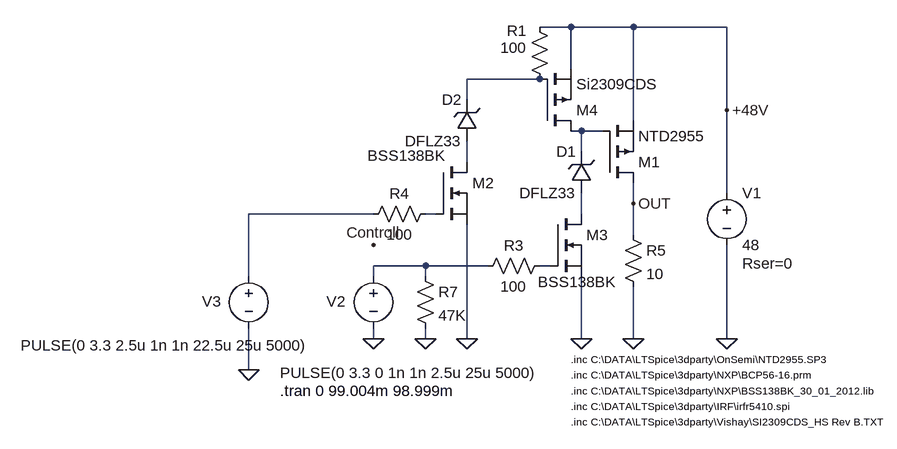
[diagram p0: schematic driver_v5_pfet_off_resistive.asc]
driver_v5_pfet_off_resistive.asc, the LTspice schematic file:
Version 4
SHEET 1 968 680
WIRE 416 -128 368 -128
WIRE 512 -128 416 -128
WIRE 656 -128 512 -128
WIRE 416 -64 416 -128
WIRE 368 -48 256 -48
WIRE 256 -16 256 -48
WIRE 656 0 656 -128
WIRE 512 16 512 -128
WIRE 432 32 416 32
WIRE 464 32 432 32
WIRE 432 64 432 32
WIRE 256 80 256 48
WIRE 656 128 656 0
WIRE 512 144 512 112
WIRE 112 160 -80 160
WIRE 208 160 192 160
WIRE 432 160 432 128
WIRE 512 192 512 144
WIRE 192 240 112 240
WIRE 288 240 192 240
WIRE 384 240 368 240
WIRE -80 256 -80 160
WIRE 112 256 112 240
WIRE 192 256 192 240
WIRE 112 352 112 336
WIRE 192 352 192 336
WIRE 256 352 256 176
WIRE 432 352 432 256
WIRE 512 352 512 272
WIRE 656 352 656 208
WIRE -80 400 -80 336
FLAG 512 352 0
FLAG 656 352 0
FLAG 112 352 0
FLAG 656 0 +48V
FLAG 112 208 Controll
FLAG 512 144 OUT
FLAG 432 352 0
FLAG 192 352 0
FLAG 256 352 0
FLAG -80 400 0
SYMBOL pmos 464 112 M180
SYMATTR InstName M1
SYMATTR Value NTD2955
SYMATTR Prefix X
SYMBOL res 352 -144 R0
WINDOW 0 -35 22 Left 2
WINDOW 3 -45 48 Left 2
SYMATTR InstName R1
SYMATTR Value 100
SYMBOL res 208 144 R90
WINDOW 0 0 56 VBottom 2
WINDOW 3 32 56 VTop 2
SYMATTR InstName R4
SYMATTR Value 100
SYMBOL res 496 176 R0
SYMATTR InstName R5
SYMATTR Value 10
SYMBOL voltage 656 112 R0
WINDOW 123 0 0 Left 2
WINDOW 39 24 124 Left 2
SYMATTR SpiceLine Rser=0
SYMATTR InstName V1
SYMATTR Value 48
SYMBOL voltage 112 240 R0
WINDOW 0 -72 55 Left 2
WINDOW 3 -144 165 Left 2
WINDOW 123 0 0 Left 2
WINDOW 39 0 0 Left 2
SYMATTR InstName V2
SYMATTR Value PULSE(0 3.3 0 1n 1n 2.5u 25u 5000)
SYMBOL zener 448 128 R180
WINDOW 0 24 64 Left 2
WINDOW 3 24 0 Left 2
SYMATTR InstName D1
SYMATTR Value DFLZ33
SYMATTR Description Diode
SYMATTR Type diode
SYMBOL nmos 208 80 R0
WINDOW 3 -105 -10 Left 2
SYMATTR Value BSS138BK
SYMATTR InstName M2
SYMATTR Prefix X
SYMBOL nmos 384 160 R0
WINDOW 3 -19 105 Left 2
SYMATTR Value BSS138BK
SYMATTR InstName M3
SYMATTR Prefix X
SYMBOL res 384 224 R90
WINDOW 0 0 56 VBottom 2
WINDOW 3 32 56 VTop 2
SYMATTR InstName R3
SYMATTR Value 100
SYMBOL res 176 240 R0
SYMATTR InstName R7
SYMATTR Value 47K
SYMBOL pmos 368 32 M180
SYMATTR InstName M4
SYMATTR Value Si2309CDS
SYMATTR Prefix X
SYMBOL zener 272 48 R180
WINDOW 0 24 64 Left 2
WINDOW 3 24 0 Left 2
SYMATTR InstName D2
SYMATTR Value DFLZ33
SYMATTR Description Diode
SYMATTR Type diode
SYMBOL voltage -80 240 R0
WINDOW 0 -72 55 Left 2
WINDOW 3 -351 122 Left 2
WINDOW 123 0 0 Left 2
WINDOW 39 0 0 Left 2
SYMATTR InstName V3
SYMATTR Value PULSE(0 3.3 2.5u 1n 1n 22.5u 25u 5000)
TEXT -32 432 Left 2 !.tran 0 99.004m 98.999m
TEXT 416 408 Left 1 !.inc C:\\DATA\\LTSpice\\3dparty\\NXP\\BCP56-16.prm
TEXT 416 432 Left 1 !.inc C:\\DATA\\LTSpice\\3dparty\\NXP\\BSS138BK_30_01_2012.lib
TEXT 416 384 Left 1 !.inc C:\\DATA\\LTSpice\\3dparty\\OnSemi\\NTD2955.SP3
TEXT 416 456 Left 1 !.inc C:\\DATA\\LTSpice\\3dparty\\IRF\\irfr5410.spi
TEXT 416 480 Left 1 !.inc C:\\DATA\\LTSpice\\3dparty\\Vishay\\SI2309CDS_HS Rev B.TXT

The netlist it stands for:
* driver_v5_pfet_off_resistive.asc
XM1 OUT N002 +48V NTD2955  ; pins D G S
R1 +48V N001 100
R4 N005 N004 100
R5 OUT 0 10
V1 +48V 0 48 Rser=0
V2 N007 0 PULSE(0 3.3 0 1n 1n 2.5u 25u 5000)
D1 N006 N002 DFLZ33
XM2 N003 N005 0 BSS138BK  ; pins D G S
XM3 N006 N008 0 BSS138BK  ; pins D G S
R3 N008 N007 100
R7 N007 0 47K
XM4 N002 N001 +48V Si2309CDS  ; pins D G S
D2 N003 N001 DFLZ33
V3 N004 0 PULSE(0 3.3 2.5u 1n 1n 22.5u 25u 5000)
.model D D
.lib standard.dio
.tran 0 99.004m 98.999m
.inc C:\DATA\LTSpice\3dparty\NXP\BCP56-16.prm
.inc C:\DATA\LTSpice\3dparty\NXP\BSS138BK_30_01_2012.lib
.inc C:\DATA\LTSpice\3dparty\OnSemi\NTD2955.SP3
.inc C:\DATA\LTSpice\3dparty\IRF\irfr5410.spi
.inc C:\DATA\LTSpice\3dparty\Vishay\SI2309CDS_HS Rev B.TXT
.backanno
.end